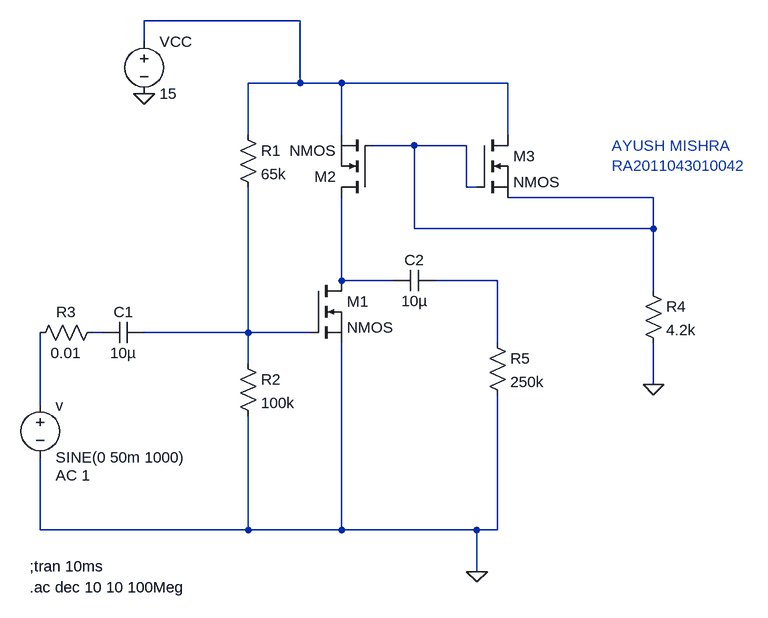
[diagram p0: schematic exp_12.2.asc]
exp_12.2.asc, the LTspice schematic file:
Version 4
SHEET 1 1232 712
WIRE 176 -176 -64 -176
WIRE -64 -144 -64 -176
WIRE 176 -80 176 -176
WIRE 176 -80 96 -80
WIRE 240 -80 176 -80
WIRE 496 -80 240 -80
WIRE 96 0 96 -80
WIRE 240 0 240 -80
WIRE 496 0 496 -80
WIRE 352 16 288 16
WIRE 432 16 352 16
WIRE 432 80 432 16
WIRE 448 80 432 80
WIRE 720 96 496 96
WIRE 352 144 352 16
WIRE 720 144 720 96
WIRE 720 144 352 144
WIRE 240 224 240 96
WIRE 320 224 240 224
WIRE 480 224 384 224
WIRE 720 240 720 144
WIRE -128 304 -144 304
WIRE 96 304 96 80
WIRE 96 304 -64 304
WIRE 192 304 96 304
WIRE 480 320 480 224
WIRE 96 352 96 304
WIRE 720 384 720 320
WIRE -224 416 -224 304
WIRE -224 608 -224 496
WIRE 96 608 96 432
WIRE 96 608 -224 608
WIRE 240 608 240 320
WIRE 240 608 96 608
WIRE 448 608 240 608
WIRE 480 608 480 400
WIRE 480 608 448 608
WIRE 448 672 448 608
FLAG 448 672 0
FLAG -64 -64 0
FLAG 720 384 0
SYMBOL res 80 -16 R0
SYMATTR InstName R1
SYMATTR Value 65k
SYMBOL res 80 336 R0
SYMATTR InstName R2
SYMATTR Value 100k
SYMBOL cap 384 208 R90
WINDOW 0 0 32 VBottom 2
WINDOW 3 32 32 VTop 2
SYMATTR InstName C2
SYMATTR Value 10µ
SYMBOL res 464 304 R0
SYMATTR InstName R5
SYMATTR Value 250k
SYMBOL cap -64 288 R90
WINDOW 0 0 32 VBottom 2
WINDOW 3 32 32 VTop 2
SYMATTR InstName C1
SYMATTR Value 10µ
SYMBOL voltage -224 400 R0
WINDOW 123 24 124 Left 2
WINDOW 39 0 0 Left 0
SYMATTR Value2 AC 1
SYMATTR InstName v
SYMATTR Value SINE(0 50m 1000)
SYMBOL voltage -64 -160 R0
WINDOW 123 0 0 Left 0
WINDOW 39 0 0 Left 0
SYMATTR InstName VCC
SYMATTR Value 15
SYMBOL nmos 192 224 R0
SYMATTR InstName M1
SYMBOL res -128 288 R90
WINDOW 0 0 56 VBottom 2
WINDOW 3 32 56 VTop 2
SYMATTR InstName R3
SYMATTR Value 0.01
SYMBOL nmos 288 96 R180
SYMATTR InstName M2
SYMBOL nmos 448 0 R0
SYMATTR InstName M3
SYMBOL res 704 224 R0
SYMATTR InstName R4
SYMATTR Value 4.2k
TEXT -240 696 Left 2 !.ac dec 10 10 100Meg
TEXT -240 664 Left 2 !;tran 10ms
TEXT 656 16 Left 2 ;AYUSH MISHRA\nRA2011043010042

The netlist it stands for:
* exp_12.2.asc
R1 N001 N006 65k
R2 N006 0 100k
C2 N004 N003 10µ
R5 N004 0 250k
C1 N006 N005 10µ
v N007 0 SINE(0 50m 1000) AC 1
VCC N001 0 15
M1 N003 N006 0 0 NMOS
R3 N005 N007 0.01
M2 N003 N002 N001 N001 NMOS
M3 N001 N002 N002 N002 NMOS
R4 N002 0 4.2k
.model NMOS NMOS
.model PMOS PMOS
.lib standard.mos
.ac dec 10 10 100Meg
;tran 10ms
* AYUSH MISHRA
* RA2011043010042
.backanno
.end